# Altium schematic sheet Mag_Enc_Sensors.SchDoc
size Letter; SheetNumber: 6; SheetTotal: 8
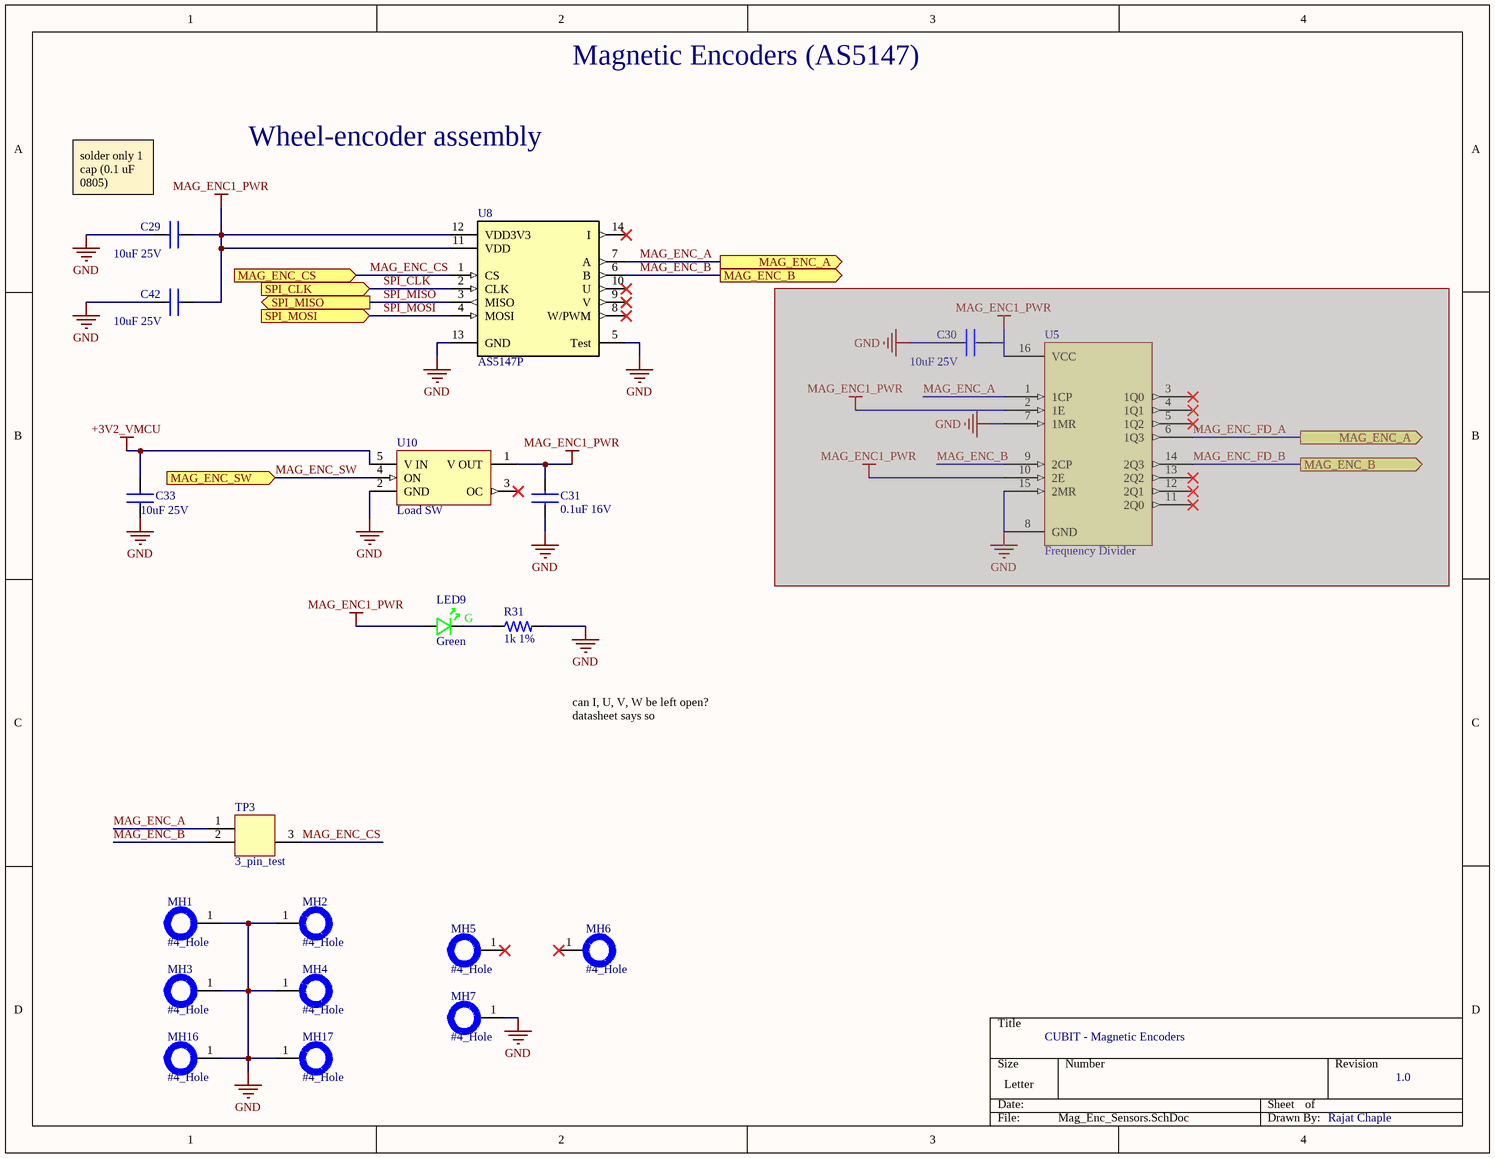
[diagram p0: Mag_Enc_Sensors.SchDoc]

## Parts
C29  10uF 25V  [CAP_0805_02X125]
C30  10uF 25V  [CAP_0805_02X125]  (masked out: inside a compile mask, not in the netlist)
C31  0.1uF 16V  [CAP_0603_1MM]
C33  10uF 25V  [CAP_0805_02X125]
C42  10uF 25V  [CAP_0805_02X125]
LED9  Green  [LED_0603_RED_WL-SMCW]
MH1  #4_Hole  [HOLE_#4]
MH2  #4_Hole  [HOLE_#4]
MH3  #4_Hole  [HOLE_#4]
MH4  #4_Hole  [HOLE_#4]
MH5  #4_Hole  [HOLE_#4]
MH6  #4_Hole  [HOLE_#4]
MH7  #4_Hole  [HOLE_#4]
MH16  #4_Hole  [HOLE_#4]
MH17  #4_Hole  [HOLE_#4]
R31  1k 1%  [2_Chip_0603_RMCF]
TP3  3_pin_test  [3_PIN_100mil]
U5  Frequency Divider  [SOIC127P600X175-16N]  (masked out: inside a compile mask, not in the netlist)
U8  AS5147P  [14-TSOP_5x4_4]
U10  Load SW  [SOT65P210X110-5N]

## Ports
MAG_ENC_A (out), MAG_ENC_B (out), MAG_ENC_CS (in), MAG_ENC_SW (in), SPI_CLK (in), SPI_MISO (out), SPI_MOSI (in)

## Nets
+3V2_VMCU: C33.1 U10.5(V_IN)
GND: C29.2 C31.2 C33.2 C42.2 MH1.1 MH2.1 MH3.1 MH4.1 MH7.1 MH16.1 MH17.1 R31.2 U8.5(Test) U8.13(GND) U10.2(GND)
MAG_ENC1_PWR: C29.1 C31.1 C42.1 LED9.A U8.11(VDD) U8.12(VDD3V3) U10.1(V_OUT)
MAG_ENC_A: TP3.1 U8.7(A) ; port MAG_ENC_A
MAG_ENC_B: TP3.2 U8.6(B) ; port MAG_ENC_B
MAG_ENC_CS: TP3.3 U8.1(CS) ; port MAG_ENC_CS
MAG_ENC_SW: U10.4(ON) ; port MAG_ENC_SW
SPI_CLK: U8.2(CLK) ; port SPI_CLK
SPI_MISO: U8.3(MISO) ; port SPI_MISO
SPI_MOSI: U8.4(MOSI) ; port SPI_MOSI
NetLED9_C: LED9.C R31.1

Not connected (* = marked no-connect by the designer): MH5 1*; MH6 1*; U8 8(W/PWM)* 9(V)* 10(U)* 14(I)*; U10 3(OC)*

## Notes on the sheet
- Magnetic Encoders (AS5147)
- Wheel-encoder assembly
- (near C29) solder only 1 cap (0.1 uF 0805)
- can I, U, V, W be left open?
  datasheet says so
- CUBIT - Magnetic Encoders
- 1.0
- Rajat Chaple
- (in symbol QBLP601-AG1) G

## Library data of the parts
C29 C30 C33 C42 = GRM21BR61E106KA73K: Cap 0805 25 V 10 uF ±20% Tolerance X5R Monolithic Ceramic Chip Capacitor; Manufacturer: Murata; Tolerance: 10%; Supplier 1: Digi-Key; Manufacturer Part Number: GRM21BR61E106KA73K; RoHS: Yes; Category: Ceramic Capacitors; Stock 1: 1875; Pricing 1: 1=0.23000, 10=0.15700, 50=0.09400, 100=0.07940, 500=0.05434, 1000=0.04807, 2500=0.04598, 5000=0.04180 (USD); Mount: Surface Mount; Case/Package: 0805; Weight: 0.000335oz; Min Operating Temperature: -55°C; Max Operating Temperature: 85°C; Packaging: Tape and Reel; Capacitance: 10uF; Voltage Rating: 25V; Package Quantity: 10000; Dielectric: X5R; Voltage Rating (DC): 25V; Length: 0.079inch; Width: 0.049inch; Thickness: 0.055inch; RoHS Compliant: Yes; ComponentLink1URL: http://www.mouser.com/ds/2/281/c02e-2905.pdf?src-supplier=Mouser; ComponentLink1Description: http://www.mouser.com/ds/2/281/c02e-2905.pdf?src-supplier=Mouser; ComponentLink2URL: http://search.murata.co.jp/Ceramy/image/img/A01X/G101/ENG/GRM21BR61E106KA73-01.pdf?src-supplier=Digi-Key; ComponentLink2Description: http://search.murata.co.jp/Ceramy/image/img/A01X/G101/ENG/GRM21BR61E106KA73-01.pdf?src-supplier=Digi-Key; ComponentLink3URL: https://search.murata.co.jp/Ceramy/image/img/A01X/G101/ENG/GRM21BR61E106KA73-01.pdf?src-supplier=Digi-Key; ComponentLink3Description: https://search.murata.co.jp/Ceramy/image/img/A01X/G101/ENG/GRM21BR61E106KA73-01.pdf?src-supplier=Digi-Key
C31 = C0805C104K4RACAUTO: Cap Ceramic 0.1uF 16V X7R 10% SMD 0603 125°C Paper T/R; Manufacturer: KEMET; Capacitance: 100nF; Supplier 1: Digi-Key; Manufacturer Part Number: C0805C104K4RACAUTO; RoHS: Yes; Category: Ceramic Capacitors; Stock 1: 15900; Pricing 1: 1=0.24000, 10=0.16200, 50=0.09700, 100=0.08190, 500=0.05606, 1000=0.04959 (USD); Case/Package: 0805; Min Operating Temperature: -55°C; Max Operating Temperature: 125°C; Tolerance: 10%; Packaging: Tape and Reel; Dielectric: X7R; Length: 2mm; Depth: 1.25mm; RoHS Compliant: Yes; ComponentLink1URL: http://components.arrow.com/part/dataview/0323_00325188?src-supplier=Arrow+Europe; ComponentLink1Description: http://components.arrow.com/part/dataview/0323_00325188?src-supplier=Arrow+Europe
LED9 = QBLP601-AG1: Led Green Clear 0603 SMD; Manufacturer: QT-Brightek; Supplier 1: Digi-Key; Manufacturer Part Number: QBLP601-AG1; RoHS: No; Stock 1: 5990; Pricing 1: 1=0.35000, 10=0.19000, 100=0.08820, 500=0.08140, 1000=0.06377, 2000=0.06242 (USD)
MH1-MH7 MH16 MH17 = Mechanical_Hole
R31 = RMCF0603FT1K00: Res 1K Ohm 1% 0.1W(1/10W) ±100ppm/C Pad SMD Automotive T/R; Manufacturer: Stackpole Electronics; Resistance: 1kR; Power Rating: 100mW; Temperature Coefficient: 100ppm/°C; Supplier 1: Digi-Key; Manufacturer Part Number: RMCF0603FT1K00; RoHS: Yes; Category: Chip SMD Resistors; Pricing 1: 1=0.10000, 10=0.01700, 100=0.00680, 1000=0.00305, 2500=0.00264 (USD); Mount: Surface Mount; Case/Package: 0603; Case Code (Metric): 1608; Case Code (Imperial): 0603; Contact Plating: Tin,Matte; Size Code: 0603; Min Operating Temperature: -55°C; Max Operating Temperature: 155°C; Tolerance: 1%; Packaging: Tape and Reel; Resistor Type: Thick Film; Number of Terminations: 2; Max Power Dissipation: 100mW; Features: Automotive AEC-Q200; Series: RMCF; Construction: Rectangular; Length: 1.55mm; Width: 0.031inch; Height: 0.022inch; Depth: 0.8mm; Radiation Hardening: No; Military Standard: Not; Lead Free: Lead Free; RoHS Compliant: Yes; ComponentLink1URL: https://www.seielect.com/catalog/sei-rmcf_rmcp.pdf?src-supplier=Digi-Key; ComponentLink1Description: https://www.seielect.com/catalog/sei-rmcf_rmcp.pdf?src-supplier=Digi-Key; ComponentLink2URL: https://www.seielect.com/catalog/SEI-RMCF_RMCP.pdf?src-supplier=Avnet; ComponentLink2Description: https://www.seielect.com/catalog/SEI-RMCF_RMCP.pdf?src-supplier=Avnet; ComponentLink3URL: https://www.seielect.com/catalog/SEI-Packaging.pdf?src-supplier=Avnet; ComponentLink3Description: https://www.seielect.com/catalog/SEI-Packaging.pdf?src-supplier=Avnet; ComponentLink4URL: https://www.seielect.com/catalog/SEI-Packaging.pdf?src-supplier=Arrow+Electronics; ComponentLink4Description: https://www.seielect.com/catalog/SEI-Packaging.pdf?src-supplier=Arrow+Electronics; ComponentLink5URL: https://www.seielect.com/catalog/SEI-RMCF_RMCP.pdf?src-supplier=Avnet+Asia; ComponentLink5Description: https://www.seielect.com/catalog/SEI-RMCF_RMCP.pdf?src-supplier=Avnet+Asia; ComponentLink6URL: http://www.seielect.com/Catalog/SEI-rmc.pdf?src-supplier=Future+Electronics; ComponentLink6Description: http://www.seielect.com/Catalog/SEI-rmc.pdf?src-supplier=Future+Electronics; ComponentLink7URL: https://www.seielect.com/catalog/SEI-Packaging.pdf?src-supplier=Verical; ComponentLink7Description: https://www.seielect.com/catalog/SEI-Packaging.pdf?src-supplier=Verical; ComponentLink8URL: https://www.seielect.com/catalog/SEI-Packaging.pdf?src-supplier=Quest; ComponentLink8Description: https://www.seielect.com/catalog/SEI-Packaging.pdf?src-supplier=Quest
U5 = CD74HC4520M96: CD74HC4520 High Speed Cmos Logic; Manufacturer: Texas Instruments; Max Supply Voltage: 6V; Min Supply Voltage: 2V; Propagation Delay: 360ns; Number of Elements: 2; Direction: Up,Unidirectional; Number of Bits per Element: 4; Reset: Asynchronous; Logic Function: Counter; Frequency: 60MHz; Sync/Async: Synchronous; Quiescent Current: 8uA; Supplier 1: Digi-Key; Manufacturer Part Number: CD74HC4520M96; RoHS: Yes; Category: Counters; Stock 1: 5254; Pricing 1: 1=0.64000, 10=0.56200, 25=0.52800, 100=0.43090, 250=0.40028, 500=0.34066, 1000=0.28121 (USD); Mount: Surface Mount; Case/Package: SOIC; Number of Pins: 16; Weight: 0.004998oz; Contact Plating: Gold; Min Operating Temperature: -55°C; Max Operating Temperature: 125°C; Packaging: Tape and Reel; Package Quantity: 2500; Number of Bits: 4; Turn-On Delay Time: 360ns; Series: 74HC; Technology: CMOS; Length: 9.9mm; Width: 3.91mm; Height: 1.58mm; Radiation Hardening: No; REACH SVHC: No SVHC; Lead Free: Lead Free; RoHS Compliant: Yes; ComponentLink1URL: https://datasheet.ciiva.com/15093/getdatasheetpartid-248732-15093616.pdf?src-supplier=Verical; ComponentLink1Description: https://datasheet.ciiva.com/15093/getdatasheetpartid-248732-15093616.pdf?src-supplier=Verical; ComponentLink2URL: https://datasheet.ciiva.com/14295/cd74hc4520-14295753.pdf?src-supplier=Avnet; ComponentLink2Description: https://datasheet.ciiva.com/14295/cd74hc4520-14295753.pdf?src-supplier=Avnet; ComponentLink3URL: https://datasheet.ciiva.com/26209/cd54hc4520-26209833.pdf?src-supplier=Avnet+Europe; ComponentLink3Description: https://datasheet.ciiva.com/26209/cd54hc4520-26209833.pdf?src-supplier=Avnet+Europe; ComponentLink4URL: https://datasheet.ciiva.com/41455/001015795-da-01-en-ic-dual-bcd-up-cd74hc4520m96-soic-16-tid-41455754.pdf?src-supplier=Conrad; ComponentLink4Description: https://datasheet.ciiva.com/41455/001015795-da-01-en-ic-dual-bcd-up-cd74hc4520m96-soic-16-tid-41455754.pdf?src-supplier=Conrad
U8 = AS5147P-HTSM: Rotary Position Sensor 5.5V/3.6V Digital Output Automotive 14-Pin TSSOP T/R; Manufacturer: ams; Encoder Type: Magnetic; Detent: No; Output Type: PWM,Quadrature,Incremental,Commutation,SPI; Supplier 1: Digi-Key; Manufacturer Part Number: AS5147P-HTSM; RoHS: Yes; Category: Integrated Circuits (ICs); Mount: Surface Mount; Termination: SMD/SMT; Built in Switch: No; Lead Free: Lead Free; RoHS Compliant: Yes; ComponentLink1URL: http://ams.com/documents/20143/36005/AS5147P_FS000142_1-00.pdf?src-supplier=Digi-Key; ComponentLink1Description: http://ams.com/documents/20143/36005/AS5147P_FS000142_1-00.pdf?src-supplier=Digi-Key; ComponentLink2URL: https://ams.com/documents/20143/36005/AS5147P_FS000142_1-00.pdf?src-supplier=Digi-Key; ComponentLink2Description: https://ams.com/documents/20143/36005/AS5147P_FS000142_1-00.pdf?src-supplier=Digi-Key; ComponentLink3URL: http://ams.com/eng/content/download/752969/1908315/394215?src-supplier=Digi-Key; ComponentLink3Description: http://ams.com/eng/content/download/752969/1908315/394215?src-supplier=Digi-Key
U10 = TPS22942DCKR: 5.5-V, 0.1-A, 500-mΩ, load switch with current limit and active low enable 5-SC70 -40 to 85; Manufacturer: Texas Instruments; Number of Outputs: 1; Output Current: 200mA; Nominal Supply Current: 1uA; Max Output Current: 100mA; Max Supply Voltage: 5.5V; Min Supply Voltage: 1.62V; Interface: On/Off; On-State Resistance: 500mR; Turn-On Delay Time: 60us; Turn-Off Delay Time: 30us; Max Supply Current: 80uA; Max Power Dissipation: 1.22mW; Quiescent Current: 40uA; Fault Protection: Over Temperature; Output Configuration: High Side; Supplier 1: Digi-Key; Manufacturer Part Number: TPS22942DCKR; RoHS: Yes; Category: Hot Swap Controllers; Stock 1: 1111; Pricing 1: 1=1.24000, 10=1.10700, 25=1.05080, 100=0.86310, 250=0.80676, 500=0.71296, 1000=0.61950 (USD); Case/Package: SC; Number of Pins: 5; Weight: 8.8E-05oz; Min Operating Temperature: -40°C; Max Operating Temperature: 85°C; Packaging: Tape and Reel; Number of Inputs: 1; Package Quantity: 3000; Max Input Voltage: 5.5V; Min Input Voltage: 1.62V; Termination: SMD/SMT; Min Current Limit: 100mA; Number of Channels: 1; Radiation Hardening: No; REACH SVHC: No SVHC; Lead Free: Lead Free; RoHS Compliant: Yes; ComponentLink1URL: https://datasheet.ciiva.com/1962/tps22945-1962436.pdf?src-supplier=Digi-Key; ComponentLink1Description: https://datasheet.ciiva.com/1962/tps22945-1962436.pdf?src-supplier=Digi-Key; ComponentLink2URL: https://datasheet.ciiva.com/15103/getdatasheetpartid-122296-15103873.pdf?src-supplier=Verical; ComponentLink2Description: https://datasheet.ciiva.com/15103/getdatasheetpartid-122296-15103873.pdf?src-supplier=Verical; ComponentLink3URL: https://datasheet.ciiva.com/1512/1840307-1512708.pdf?src-supplier=Element14; ComponentLink3Description: https://datasheet.ciiva.com/1512/1840307-1512708.pdf?src-supplier=Element14; ComponentLink4URL: https://datasheet.ciiva.com/1963/tps22942-1963503.pdf?src-supplier=Digi-Key; ComponentLink4Description: https://datasheet.ciiva.com/1963/tps22942-1963503.pdf?src-supplier=Digi-Key; ComponentLink5URL: https://datasheet.ciiva.com/1963/tps22942-1963502.pdf?src-supplier=Digi-Key; ComponentLink5Description: https://datasheet.ciiva.com/1963/tps22942-1963502.pdf?src-supplier=Digi-Key; ComponentLink6URL: https://datasheet.ciiva.com/3233/tps22945-3233582.pdf?src-supplier=Avnet; ComponentLink6Description: https://datasheet.ciiva.com/3233/tps22945-3233582.pdf?src-supplier=Avnet; ComponentLink7URL: https://datasheet.ciiva.com/26074/tps22945-26074375.pdf?src-supplier=Avnet+Europe; ComponentLink7Description: https://datasheet.ciiva.com/26074/tps22945-26074375.pdf?src-supplier=Avnet+Europe